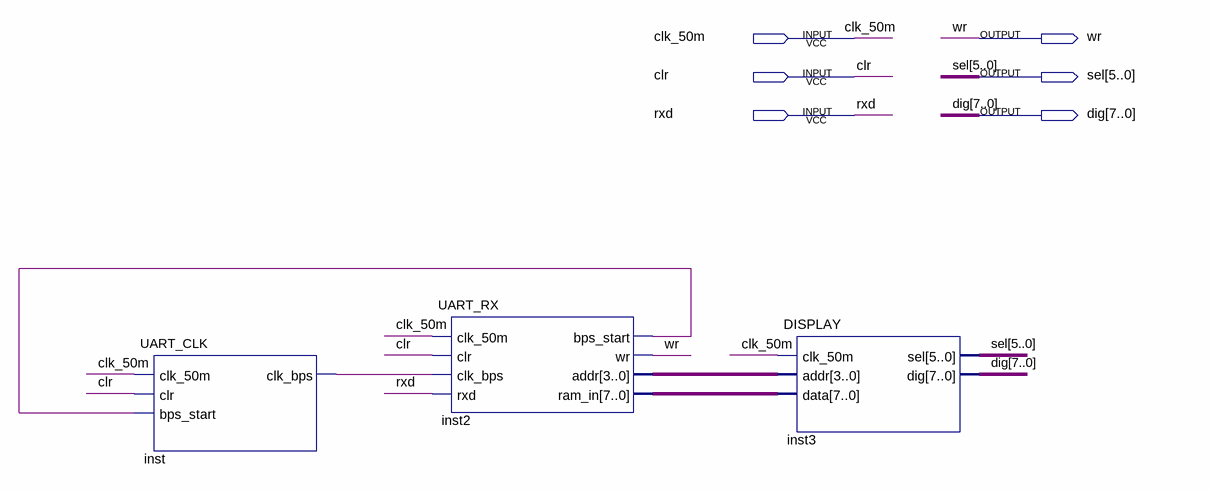
[diagram p0: schematic sheet]
// Quartus schematic input.bdf as structural Verilog: 3 symbols, 6 pins
module \input  (
  input  clk_50m,
  input  clr,
  input  rxd,
  output wr,
  output [5:0] sel,
  output [7:0] dig
);

  wire inst2_bps_start, inst_clk_bps;
  wire [3:0] inst2_addr;
  wire [7:0] inst2_ram_in;

  UART_CLK inst (.clk_50m(clk_50m), .clr(clr), .bps_start(inst2_bps_start), .clk_bps(inst_clk_bps));
  UART_RX inst2 (
    .clk_50m(clk_50m), .clr(clr), .clk_bps(inst_clk_bps), .rxd(rxd), .bps_start(inst2_bps_start), .wr(wr),
    .addr(inst2_addr), .ram_in(inst2_ram_in));
  DISPLAY inst3 (.clk_50m(clk_50m), .addr(inst2_addr), .data(inst2_ram_in), .sel(sel), .dig(dig));
endmodule
